# Altium project Power_Board_DRV8323.PrjPcb
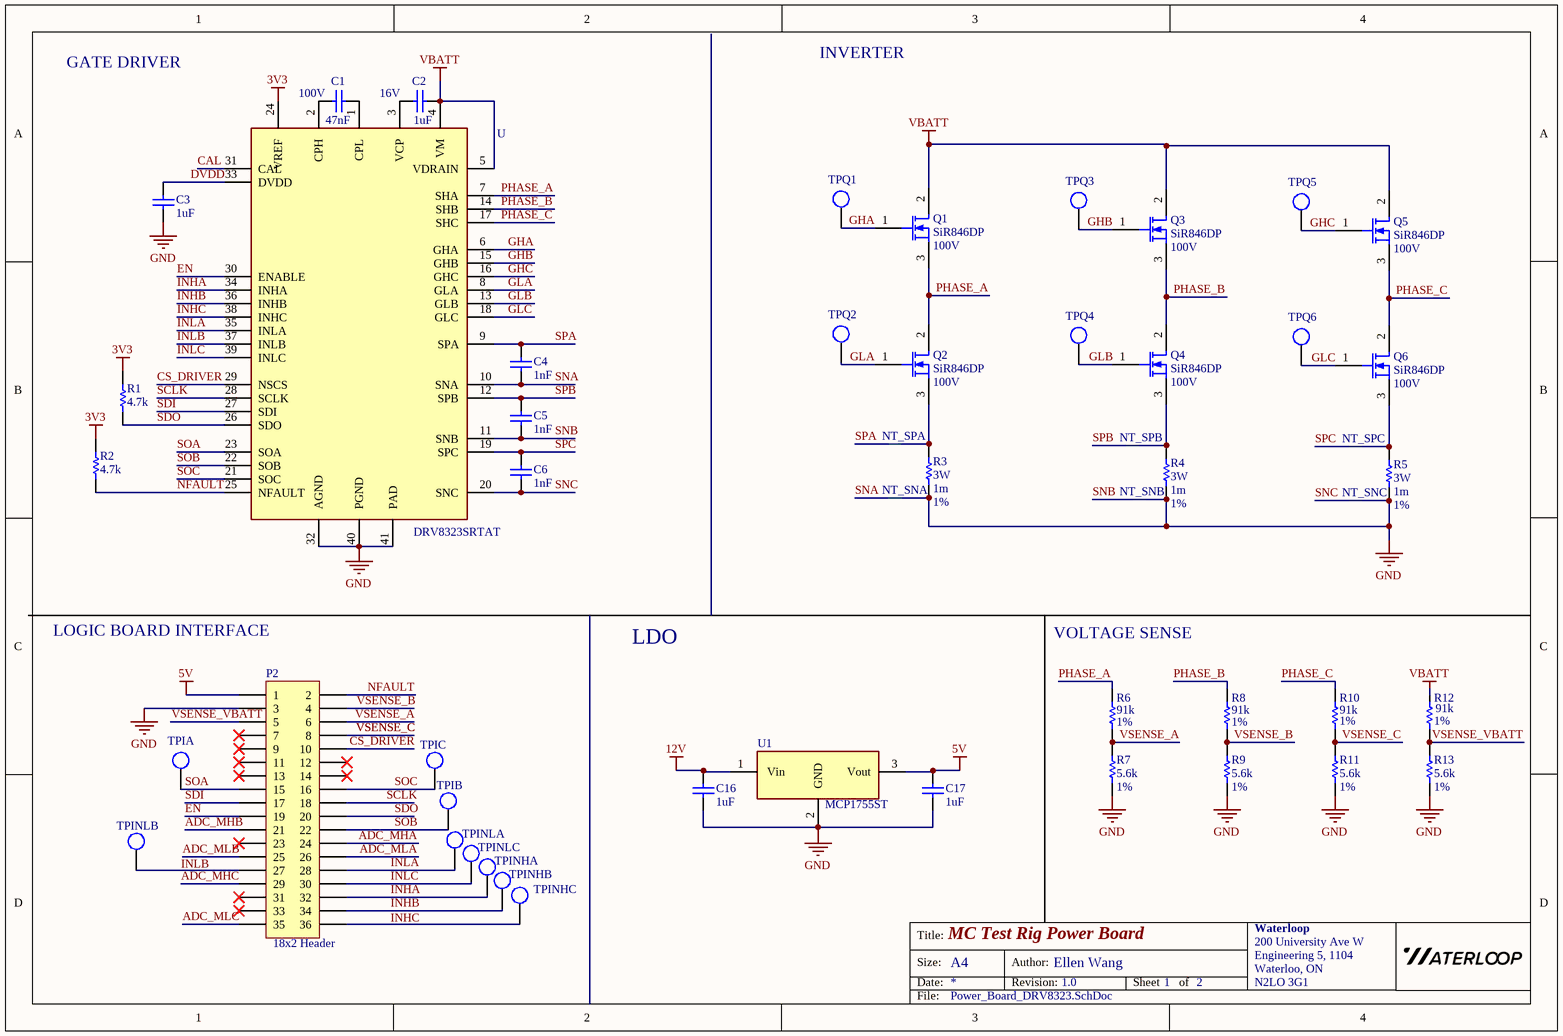
[diagram p0: Power_Board_DRV8323.SchDoc]
2 sheets, 86 parts. Net scope: global (net labels, ports and power ports of the same name join across sheets).
Board file: Power_Board_DRV8323.PcbDoc
Sheets:
  Power_Board_DRV8323.SchDoc
  Power_Board_Components.SchDoc

## Sheet Power_Board_DRV8323.SchDoc: MC Test Rig Power Board
size A4; Author: Ellen Wang; Organization: Waterloop; Address1: 200 University Ave W; Address2: Engineering 5, 1104; Address3: Waterloo, ON; Address4: N2LO 3G1; Revision: 1.0; SheetNumber: 1; SheetTotal: 2

### Parts
C1  value 47nF  Rating: 100V  [0805 - Capacitor]  (hidden comment: Capacitor - Nonpolarized)
C2  value 1uF  Rating: 16V  [0805 - Capacitor]  (hidden comment: Capacitor - Nonpolarized)
C3  value 1uF  [0805 - Capacitor]  (hidden comment: Capacitor - Nonpolarized)
C4  value 1nF  [0805 - Capacitor]  (hidden comment: Capacitor - Nonpolarized)
C5  value 1nF  [0805 - Capacitor]  (hidden comment: Capacitor - Nonpolarized)
C6  value 1nF  [0805 - Capacitor]  (hidden comment: Capacitor - Nonpolarized)
C16  value 1uF  [0805 - Capacitor]  (hidden comment: Capacitor - Nonpolarized)
C17  value 1uF  [0805 - Capacitor]  (hidden comment: Capacitor - Nonpolarized)
NT_SNA  NetTie  [Net Tie]  (value not drawn)  (net tie, no BOM)
NT_SNB  NetTie  [Net Tie]  (value not drawn)  (net tie, no BOM)
NT_SNC  NetTie  [Net Tie]  (value not drawn)  (net tie, no BOM)
NT_SPA  NetTie  [Net Tie]  (value not drawn)  (net tie, no BOM)
NT_SPB  NetTie  [Net Tie]  (value not drawn)  (net tie, no BOM)
NT_SPC  NetTie  [Net Tie]  (value not drawn)  (net tie, no BOM)
P2  Header 18X2  [HDR2X18]  (value not drawn)
Q1  Supplier Part Number: SiR846DP  Rating: 100V  [PowerPAK® SO-8]  (hidden comment: MOSFET-N)
Q2  Supplier Part Number: SiR846DP  Rating: 100V  [PowerPAK® SO-8]  (hidden comment: MOSFET-N)
Q3  Supplier Part Number: SiR846DP  Rating: 100V  [PowerPAK® SO-8]  (hidden comment: MOSFET-N)
Q4  Supplier Part Number: SiR846DP  Rating: 100V  [PowerPAK® SO-8]  (hidden comment: MOSFET-N)
Q5  Supplier Part Number: SiR846DP  Rating: 100V  [PowerPAK® SO-8]  (hidden comment: MOSFET-N)
Q6  Supplier Part Number: SiR846DP  Rating: 100V  [PowerPAK® SO-8]  (hidden comment: MOSFET-N)
R1  value 4.7k  [0603 - Resistor]  (hidden comment: Resistor)
R2  value 4.7k  [0603 - Resistor]  (hidden comment: Resistor)
R3  value 1m  Rating: 3W  Tolerance: 1%  [2512 - RESISTOR]  (hidden comment: Resistor)
R4  value 1m  Rating: 3W  Tolerance: 1%  [2512 - RESISTOR]  (hidden comment: Resistor)
R5  value 1m  Rating: 3W  Tolerance: 1%  [2512 - RESISTOR]  (hidden comment: Resistor)
R6  value 91k  Tolerance: 1%  [0603 - Resistor]  (hidden comment: Resistor)
R7  value 5.6k  Tolerance: 1%  [0603 - Resistor]  (hidden comment: Resistor)
R8  value 91k  Tolerance: 1%  [0603 - Resistor]  (hidden comment: Resistor)
R9  value 5.6k  Tolerance: 1%  [0603 - Resistor]  (hidden comment: Resistor)
R10  value 91k  Tolerance: 1%  [0603 - Resistor]  (hidden comment: Resistor)
R11  value 5.6k  Tolerance: 1%  [0603 - Resistor]  (hidden comment: Resistor)
R12  value 91k  Tolerance: 1%  [0603 - Resistor]  (hidden comment: Resistor)
R13  value 5.6k  Tolerance: 1%  [0603 - Resistor]  (hidden comment: Resistor)
TPIA  Test Point  [Test Point]  (value not drawn)  (no BOM)
TPIB  Test Point  [Test Point]  (value not drawn)  (no BOM)
TPIC  Test Point  [Test Point]  (value not drawn)  (no BOM)
TPINHA  Test Point  [Test Point]  (value not drawn)  (no BOM)
TPINHB  Test Point  [Test Point]  (value not drawn)  (no BOM)
TPINHC  Test Point  [Test Point]  (value not drawn)  (no BOM)
TPINLA  Test Point  [Test Point]  (value not drawn)  (no BOM)
TPINLB  Test Point  [Test Point]  (value not drawn)  (no BOM)
TPINLC  Test Point  [Test Point]  (value not drawn)  (no BOM)
TPQ1  Test Point  [Test Point]  (value not drawn)  (no BOM)
TPQ2  Test Point  [Test Point]  (value not drawn)  (no BOM)
TPQ3  Test Point  [Test Point]  (value not drawn)  (no BOM)
TPQ4  Test Point  [Test Point]  (value not drawn)  (no BOM)
TPQ5  Test Point  [Test Point]  (value not drawn)  (no BOM)
TPQ6  Test Point  [Test Point]  (value not drawn)  (no BOM)
U  DRV8323SRTAT  [DRV8323SRTAT]
U1  MCP1755ST  [MCP1755ST]  (value not drawn)

### Nets
3V3: R1.2 R2.2 U.24(VREF)
5V: C17.2 P2.1 U1.3(Vout)
12V: C16.2 U1.1(Vin)
GND: C3.1 C16.1 C17.1 NT_SNA.2 NT_SNB.2 NT_SNC.2 P2.3 R3.1 R4.1 R5.1 R7.2 R9.2 R11.2 R13.2 U1.2(GND)
VBATT: C2.2 Q1.2(D) Q3.2(D) Q5.2(D) R12.1 U.4(VM) U.5(VDRAIN)
ADC_MHA: P2.24
ADC_MHB: P2.21
ADC_MHC: P2.29
ADC_MLA: P2.26
ADC_MLB: P2.25
ADC_MLC: P2.35
CAL: U.31(CAL)
CS_DRIVER: P2.10 U.29(NSCS)
DVDD: C3.2 U.33(DVDD)
EN: P2.19 U.30(ENABLE)
GHA: Q1.1(G) TPQ1.1 U.6(GHA)
GHB: Q3.1(G) TPQ3.1 U.15(GHB)
GHC: Q5.1(G) TPQ5.1 U.16(GHC)
GLA: Q2.1(G) TPQ2.1 U.8(GLA)
GLB: Q4.1(G) TPQ4.1 U.13(GLB)
GLC: Q6.1(G) TPQ6.1 U.18(GLC)
INHA: P2.32 TPINHA.1 U.34(INHA)
INHB: P2.34 TPINHB.1 U.36(INHB)
INHC: U.38(INHC)
INLA: P2.28 TPINLA.1 U.35(INLA)
INLB: U.37(INLB)
INLC: P2.30 TPINLC.1 U.39(INLC)
NFAULT: P2.2 R2.1 U.25(NFAULT)
PHASE_A: Q1.3(S) Q2.2(D) R6.1 U.7(SHA)
PHASE_B: Q3.3(S) Q4.2(D) R8.1 U.14(SHB)
PHASE_C: Q5.3(S) Q6.2(D) R10.1 U.17(SHC)
SCLK: P2.18 U.28(SCLK)
SDI: P2.17 U.27(SDI)
SDO: P2.20 R1.1 U.26(SDO)
SNA: C4.1 NT_SNA.1 U.10(SNA)
SNB: C5.1 NT_SNB.1 U.11(SNB)
SNC: C6.1 NT_SNC.1 U.20(SNC)
SOA: P2.15 TPIA.1 U.23(SOA)
SOB: P2.22 TPIB.1 U.22(SOB)
SOC: P2.16 TPIC.1 U.21(SOC)
SPA: C4.2 NT_SPA.1 U.9(SPA)
SPB: C5.2 NT_SPB.1 U.12(SPB)
SPC: C6.2 NT_SPC.1 U.19(SPC)
VSENSE_A: P2.6 R6.2 R7.1
VSENSE_B: P2.4 R8.2 R9.1
VSENSE_C: P2.8 R10.2 R11.1
VSENSE_VBATT: P2.5 R12.2 R13.1
NetC1_1: C1.1 U.2(CPH)
NetC1_2: C1.2 U.1(CPL)
NetC2_1: C2.1 U.3(VCP)
NetNT_SPA_2: NT_SPA.2 Q2.3(S) R3.2
NetNT_SPB_2: NT_SPB.2 Q4.3(S) R4.2
NetNT_SPC_2: NT_SPC.2 Q6.3(S) R5.2
NetP2_27: P2.27 TPINLB.1
NetP2_36: P2.36 TPINHC.1
NetU_32: U.32(AGND) U.40(PGND) U.41(PAD)

Not connected (* = marked no-connect by the designer): P2 7* 9* 11* 12* 13* 14* 23* 31* 33*

### Notes on the sheet
- GATE DRIVER
- INVERTER
- LOGIC BOARD INTERFACE
- LDO
- VOLTAGE SENSE
- (near P2) 18x2 Header
- Labels drawn without touching a wire or pin: GND, INHC, INLB
- Title:
- Size:
- Date:
- A4
- Author:
- Revision:
- Sheet
- of
- File:

### Library data of the parts
C1 = Capacitor - Nonpolarized: Nonpolarized Capacitor; Manufacturer: YAGEO; Manufacturer Part Number: CC0805KKX7R0BB473; Supplier Part Number: 311-1876-1-ND; Supplier: Digikey
C2 = Capacitor - Nonpolarized: Nonpolarized Capacitor; Manufacturer: YAGEO; Manufacturer Part Number: CC0805KKX7R7BB105; Supplier Part Number: 311-1365-1-ND; Supplier: Digikey; Parameter 1: *
C3 = Capacitor - Nonpolarized: Nonpolarized Capacitor; Manufacturer: YAGEO; Manufacturer Part Number: CC0805KKX7R7BB105; Rating: 16V; Supplier Part Number: 311-1365-1-ND; Supplier: Digikey
C4-C6 = Capacitor - Nonpolarized: Nonpolarized Capacitor; Manufacturer: YAGEO; Manufacturer Part Number: CC0805KRX7R0BB102; Rating: 100V; Supplier Part Number: 311-1472-1-ND; Supplier: Digikey
C16 C17 = Capacitor - Nonpolarized: Nonpolarized Capacitor; Supplier Part Number: *; Supplier: *; Manufacturer: *; Rating: *; Manufacturer Part Number: *
NT_SNA NT_SNB NT_SNC NT_SPA NT_SPB NT_SPC = Net Tie
P2 = Header 18X2: Header, 18-Pin, Dual row; LatestRevisionDate: 17-Jul-2002; LatestRevisionNote: Re-released for DXP Platform.; Publisher: Altium Limited
Q1-Q6 = MOSFET-N: N-Channel MOSFET; Supplier: *; Manufacturer Part Number: *; Manufacturer: *; Value: *
R1 R2 = Resistor: Manufacturer Part Number: RC0603FR-074K7L; Manufacturer: YAGEO; Rating: *; Supplier Part Number: 311-4.70KHRCT-ND; Supplier: Digikey
R3-R5 = Resistor: Manufacturer Part Number: CSR2512C0R001F; Manufacturer: Riedon; Supplier Part Number: 696-1185-1-ND; Supplier: Digikey
R6 R8 R10 R12 = Resistor: Manufacturer Part Number: RC0603FR-0791KL; Manufacturer: YAGEO; Supplier Part Number: 311-91.0KHRCT-ND; Supplier: Digikey
R7 R9 R11 R13 = Resistor: Manufacturer Part Number: RC0603FR-075K6L; Manufacturer: YAGEO; Rating: *; Supplier Part Number: 311-5.60KHRCT-ND; Supplier: Digikey
U = DRV8323SRTAT: Multiphase Motor Driver Power MOSFET SPI; Manufacturer: Texas Instruments; Manufacturer Part Number: DRV8323SRTAT; Supplier: Digikey; Supplier Part Number: 296-47095-1-ND; ComponentLink1Description: Datasheet; ComponentLink1URL: https://www.ti.com/lit/ds/symlink/drv8323.pdf?HQS=dis-dk-null-digikeymode-dsf-pf-null-wwe&ts=1623708117864

## Sheet Power_Board_Components.SchDoc: Powerboard Components
size A4; Author: Ellen Wang; Organization: Waterloop; Address1: 200 University Ave W; Address2: Engineering 5, 1104; Address3: Waterloo, ON; Address4: N2LO 3G1; Revision: 1.1; SheetNumber: 2; SheetTotal: 2
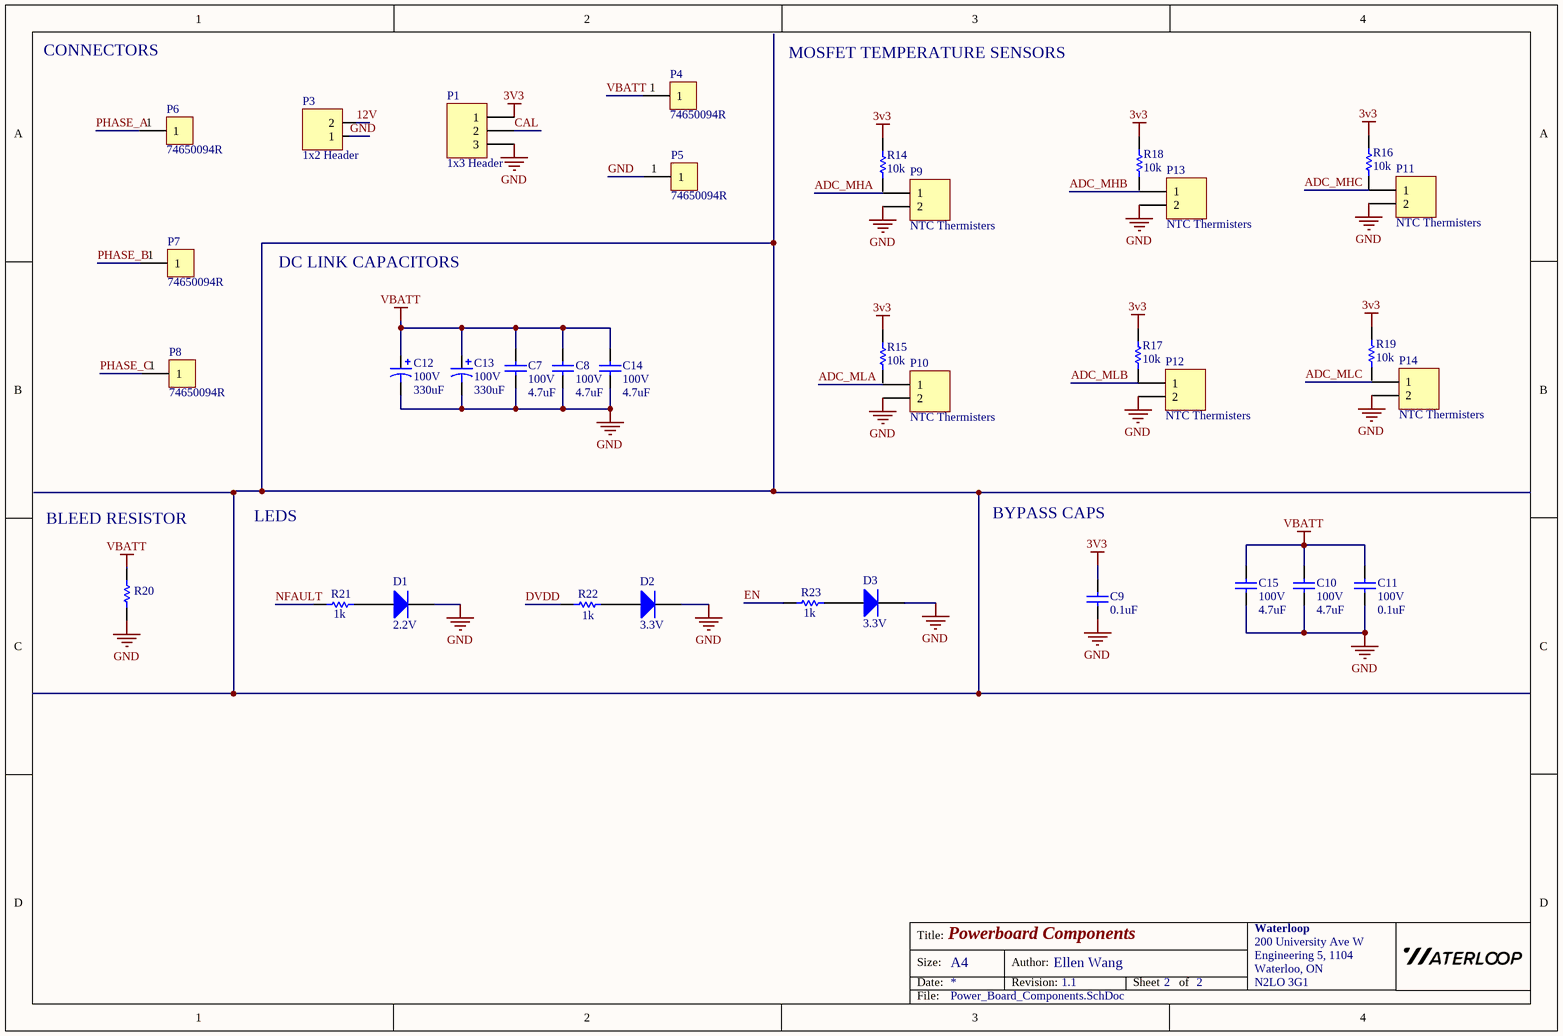
[diagram p1: Power_Board_Components.SchDoc]

### Parts
C7  value 4.7uF  Rating: 100V  [1210 - Capacitor]  (hidden comment: Capacitor - Nonpolarized)
C8  value 4.7uF  Rating: 100V  [1210 - Capacitor]  (hidden comment: Capacitor - Nonpolarized)
C9  value 0.1uF  [0805 - Capacitor]  (hidden comment: Capacitor - Nonpolarized)
C10  value 4.7uF  Rating: 100V  [1210 - Capacitor]  (hidden comment: Capacitor - Nonpolarized)
C11  value 0.1uF  Rating: 100V  [0805 - Capacitor]  (hidden comment: Capacitor - Nonpolarized)
C12  value 330uF  Rating: 100V  [OCVZ0606 - CAPACITOR]  (hidden comment: Capacitor - Polarized)
C13  value 330uF  Rating: 100V  [OCVZ0606 - CAPACITOR]  (hidden comment: Capacitor - Polarized)
C14  value 4.7uF  Rating: 100V  [1210 - Capacitor]  (hidden comment: Capacitor - Nonpolarized)
C15  value 4.7uF  Rating: 100V  [1210 - Capacitor]  (hidden comment: Capacitor - Nonpolarized)
D1  value 2.2V  [0805 - DIODE]  (hidden comment: Diode)
D2  value 3.3V  [0805 - DIODE]  (hidden comment: Diode)
D3  value 3.3V  [0805 - DIODE]  (hidden comment: Diode)
P1  1x3 Header  [HDR1X3]
P3  1x2 Header  [HDR1X2]
P4  74650094R  [74650094R]
P5  74650094R  [74650094R]
P6  74650094R  [74650094R]
P7  74650094R  [74650094R]
P8  74650094R  [74650094R]
P9  NTC Thermisters  [HDR1X2]
P10  NTC Thermisters  [HDR1X2]
P11  NTC Thermisters  [HDR1X2]
P12  NTC Thermisters  [HDR1X2]
P13  NTC Thermisters  [HDR1X2]
P14  NTC Thermisters  [HDR1X2]
R14  value 10k  [0603 - Resistor]  (hidden comment: Resistor)
R15  value 10k  [0603 - Resistor]  (hidden comment: Resistor)
R16  value 10k  [0603 - Resistor]  (hidden comment: Resistor)
R17  value 10k  [0603 - Resistor]  (hidden comment: Resistor)
R18  value 10k  [0603 - Resistor]  (hidden comment: Resistor)
R19  value 10k  [0603 - Resistor]  (hidden comment: Resistor)
R20  Resistor  [0603 - Resistor]  (value not drawn)  (no BOM)
R21  value 1k  [0603 - Resistor]  (hidden comment: Resistor)
R22  value 1k  [0603 - Resistor]  (hidden comment: Resistor)
R23  value 1k  [0603 - Resistor]  (hidden comment: Resistor)

### Nets
3V3: C9.1 P1.1 R14.2 R15.2 R16.2 R17.2 R18.2 R19.2
12V: P3.2
GND: C7.2 C8.2 C9.2 C10.2 C11.2 C12.2 C13.2 C14.2 C15.2 D1.2(K) D2.2(K) D3.2(K) P1.3 P3.1 P5.1 P9.2 P10.2 P11.2 P12.2 P13.2 P14.2 R20.1
VBATT: C7.1 C8.2 C10.2 C11.2 C12.1 C13.1 C14.2 C15.2 P4.1 R20.2
ADC_MHA: P9.1
ADC_MHB: P13.1
ADC_MHC: P11.1
ADC_MLA: P10.1
ADC_MLB: P12.1
ADC_MLC: P14.1
CAL: P1.2
DVDD: R22.1
EN: R23.1
NFAULT: R21.1
PHASE_A: P6.1
PHASE_B: P7.1
PHASE_C: P8.1
NetD1_1: D1.1(A) R21.2
NetD2_1: D2.1(A) R22.2
NetD3_1: D3.1(A) R23.2

Not connected (* = marked no-connect by the designer): R14 1; R15 1; R16 1; R17 1; R18 1; R19 1

### Notes on the sheet
- CONNECTORS
- MOSFET TEMPERATURE SENSORS
- DC LINK CAPACITORS
- BYPASS CAPS
- (near R20) BLEED RESISTOR
- LEDS
- (near R20) DNP
- Title:
- Size:
- Date:
- A4
- Author:
- Revision:
- Sheet
- of
- File:

### Library data of the parts
C7 C8 C10 C14 C15 = Capacitor - Nonpolarized: Nonpolarized Capacitor; Manufacturer: Holy Stone Enterprise Co., Ltd.; Manufacturer Part Number: C1210X475K101T; Supplier Part Number: 2873-C1210X475K101TCT-ND; Supplier: Digikey
C9 = Capacitor - Nonpolarized: Nonpolarized Capacitor; Manufacturer: Samsung Electro-Mechanics; Manufacturer Part Number: CL21B104KCFWPNE; Rating: 100V; Supplier Part Number: 1276-6733-1-ND; Supplier: Digikey
C11 = Capacitor - Nonpolarized: Nonpolarized Capacitor; Manufacturer: Samsung Electro-Mechanics; Manufacturer Part Number: CL21B104KCFWPNE; Supplier Part Number: 1276-6733-1-ND; Supplier: Digikey
C12 C13 = Capacitor - Polarized: Polarized Capacitor; Manufacturer: Panasonic Electronic Components; Manufacturer Part Number: EEE-FK2A331AM; Supplier: Digikey; Supplier Part Number: PCE4867CT-ND
D1 = Diode: Manufacturer: SunLED; Manufacturer Part Number: XZM2CRK54WRP-1; Rating: *; Supplier Part Number: 1497-XZM2CRK54WRP-1CT-ND; Supplier: Digikey
D2 D3 = Diode: Manufacturer: SunLED; Manufacturer Part Number: XZDGK54W-8; Rating: *; Supplier Part Number: 1497-1435-1-ND; Supplier: Digkey
P1 = 1x3 Header: 1x3 Pin Header
P3 = 1x2 Header: 1x2 Pin Header
P4-P8 = 74650094R: Manufacturer: Wurth; Manufacturer Part Number: 74650094R; Supplier Part Number: 732-10884-1-ND; Supplier: Digikey
P9-P14 = Header 2: Header, 2-Pin; LatestRevisionDate: 17-Jul-2002; LatestRevisionNote: Re-released for DXP Platform.; Publisher: Altium Limited
R20 = Resistor: Rating: 100V; Manufacturer Part Number: *; Manufacturer: *; Supplier Part Number: *; Supplier: *; Value: *
R14-R19 R21-R23 = Resistor: Rating: *; Manufacturer Part Number: *; Manufacturer: *; Supplier Part Number: *; Supplier: *

## Nets that join several sheets
3V3: Power_Board_DRV8323 (R1.2 R2.2 U.24), Power_Board_Components (8 pins)
12V: Power_Board_DRV8323 (C16.2 U1.1), Power_Board_Components (P3.2)
GND: Power_Board_DRV8323 (15 pins), Power_Board_Components (22 pins)
VBATT: Power_Board_DRV8323 (7 pins), Power_Board_Components (10 pins)
ADC_MHA: Power_Board_DRV8323 (P2.24), Power_Board_Components (P9.1)
ADC_MHB: Power_Board_DRV8323 (P2.21), Power_Board_Components (P13.1)
ADC_MHC: Power_Board_DRV8323 (P2.29), Power_Board_Components (P11.1)
ADC_MLA: Power_Board_DRV8323 (P2.26), Power_Board_Components (P10.1)
ADC_MLB: Power_Board_DRV8323 (P2.25), Power_Board_Components (P12.1)
ADC_MLC: Power_Board_DRV8323 (P2.35), Power_Board_Components (P14.1)
CAL: Power_Board_DRV8323 (U.31), Power_Board_Components (P1.2)
DVDD: Power_Board_DRV8323 (C3.2 U.33), Power_Board_Components (R22.1)
EN: Power_Board_DRV8323 (P2.19 U.30), Power_Board_Components (R23.1)
NFAULT: Power_Board_DRV8323 (P2.2 R2.1 U.25), Power_Board_Components (R21.1)
PHASE_A: Power_Board_DRV8323 (Q1.3 Q2.2 R6.1 U.7), Power_Board_Components (P6.1)
PHASE_B: Power_Board_DRV8323 (Q3.3 Q4.2 R8.1 U.14), Power_Board_Components (P7.1)
PHASE_C: Power_Board_DRV8323 (Q5.3 Q6.2 R10.1 U.17), Power_Board_Components (P8.1)